# EAGLE design k64f-kit (EAGLE 9.6.2)
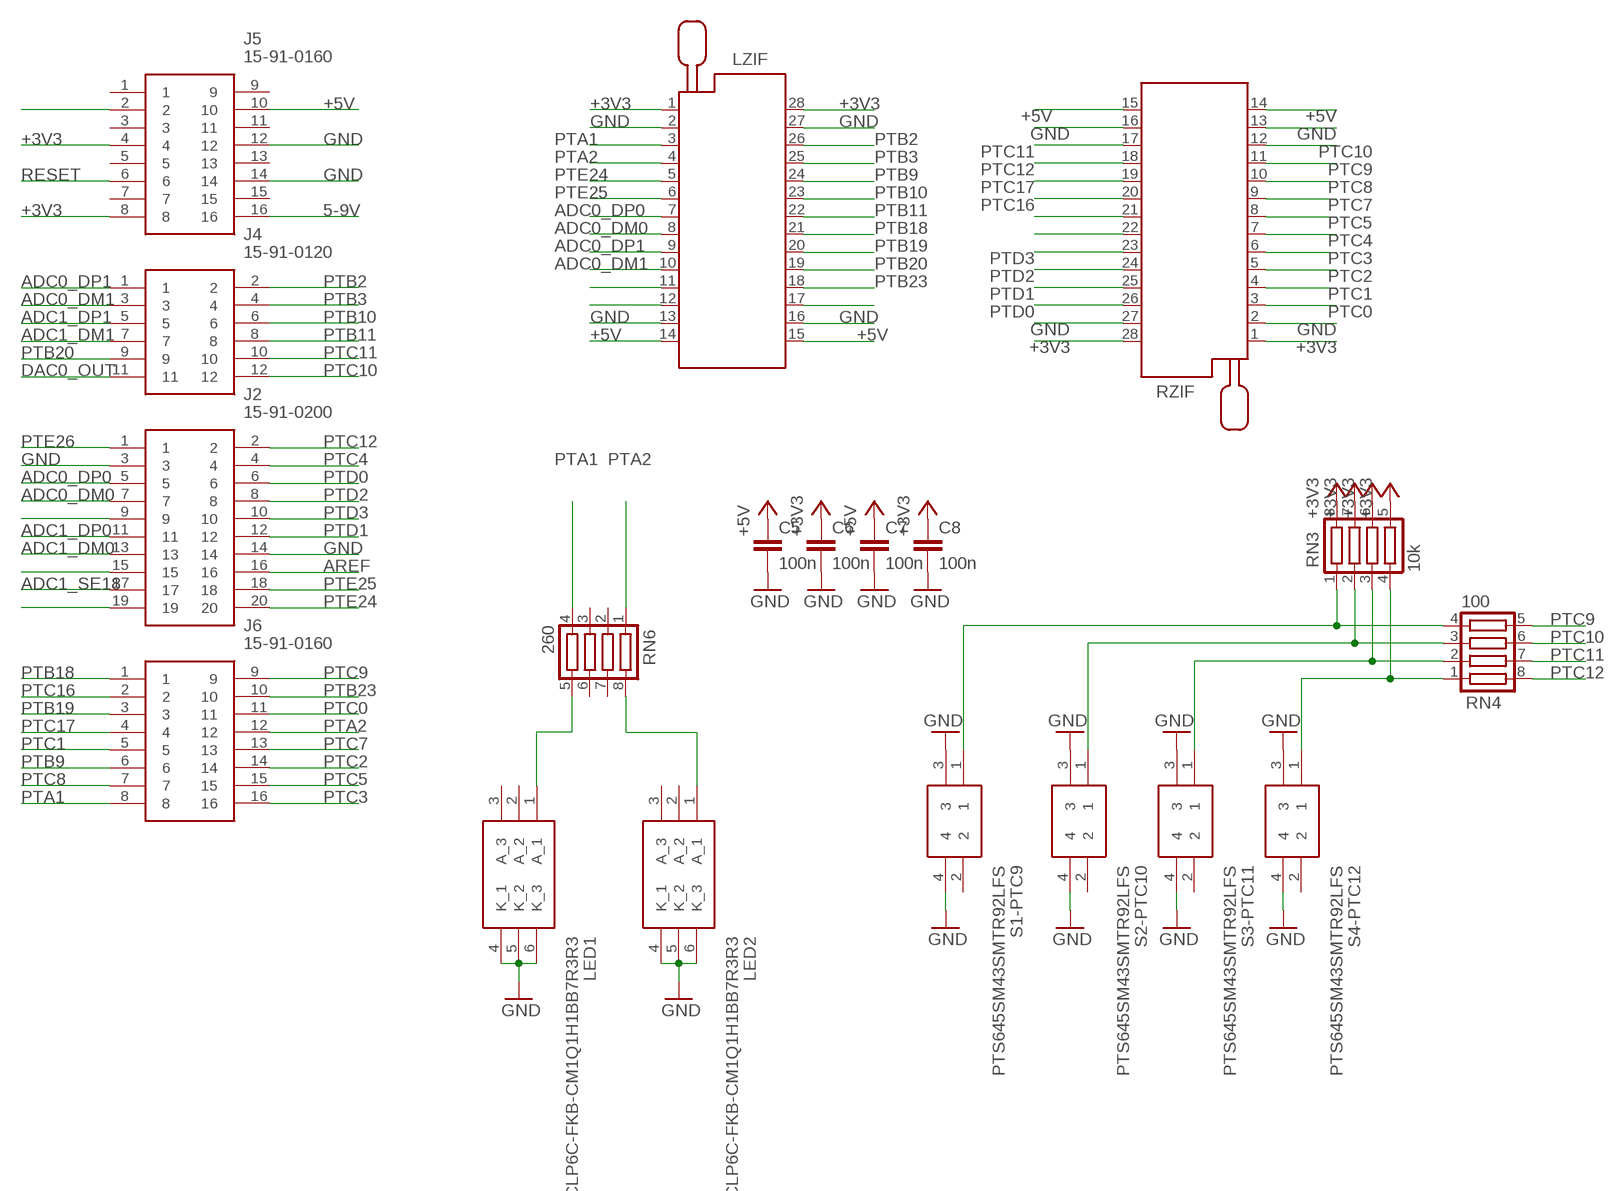
[diagram p0: schematic, sheet 1]

## Parts
C5  100n  C-EUC1206  [C1206]
C6  100n  C-EUC1206  [C1206]
C7  100n  C-EUC1206  [C1206]
C8  100n  C-EUC1206  [C1206]
J2  15-91-0200  [15910200]
J4  15-91-0120  [15910120]
J5  15-91-0160  [15910160]
J6  15-91-0160  [15910160]
LED1  CLP6C-FKB-CM1Q1H1BB7R3R3  [CLP6CFKBCM1Q1H1BB7R3R3]
LED2  CLP6C-FKB-CM1Q1H1BB7R3R3  [CLP6CFKBCM1Q1H1BB7R3R3]
LZIF  228-22-602  [228-1277-00-0602J]
RN3  10k  CTS742C083  [CTS742C083]
RN4  100  CTS742C083  [CTS742C083]
RN6  260  CTS742C083  [CTS742C083]
RZIF  228-22-602  [228-1277-00-0602J]
S1-PTC9  PTS645SM43SMTR92LFS  [PTS645(SMT)]
S2-PTC10  PTS645SM43SMTR92LFS  [PTS645(SMT)]
S3-PTC11  PTS645SM43SMTR92LFS  [PTS645(SMT)]
S4-PTC12  PTS645SM43SMTR92LFS  [PTS645(SMT)]

## Nets
5-9V: J5.16
+3V3: C6.1 C8.1 J5.4 J5.8 LZIF.1 LZIF.28 RN3.5 RN3.6 RN3.7 RN3.8 RZIF.1 RZIF.28
+5V: C5.1 C7.1 J5.10 LZIF.14 LZIF.15 RZIF.14 RZIF.15
ADC0_DM0: J2.7 LZIF.8
ADC0_DM1: J4.3 LZIF.10
ADC0_DP0: J2.5 LZIF.7
ADC0_DP1: J4.1 LZIF.9
ADC1_DM0: J2.13
ADC1_DM1: J4.7
ADC1_DP0: J2.11
ADC1_DP1: J4.5
ADC1_SE18: J2.17
AREF: J2.16
DAC0_OUT: J4.11
GND: C5.2 C6.2 C7.2 C8.2 J2.3 J2.14 J5.12 J5.14 LED1.4(K_1) LED1.5(K_2) LED1.6(K_3) LED2.4(K_1) LED2.5(K_2) LED2.6(K_3) LZIF.2 LZIF.13 LZIF.16 LZIF.27 RZIF.2 RZIF.13 RZIF.16 RZIF.27 S1-PTC9.3 S1-PTC9.4 S2-PTC10.3 S2-PTC10.4 S3-PTC11.3 S3-PTC11.4 S4-PTC12.3 S4-PTC12.4
N$1: J5.2
N$10: RN3.1 RN4.4 S1-PTC9.1
N$11: RN3.2 RN4.3 S2-PTC10.1
N$12: LZIF.11
N$13: LZIF.12
N$19: RN3.3 RN4.2 S3-PTC11.1
N$20: RN3.4 RN4.1 S4-PTC12.1
N$27: LZIF.17
N$35: J2.15
N$37: J2.19
N$38: LED2.1(A_1) RN6.8
N$39: LED1.1(A_1) RN6.5
N$46: J2.9
N$50: RZIF.22
N$51: RZIF.21
PTA1: J6.8 LZIF.3 RN6.1
PTA2: J6.12 LZIF.4 RN6.4
PTB2: J4.2 LZIF.26
PTB3: J4.4 LZIF.25
PTB9: J6.6 LZIF.24
PTB10: J4.6 LZIF.23
PTB11: J4.8 LZIF.22
PTB18: J6.1 LZIF.21
PTB19: J6.3 LZIF.20
PTB20: J4.9 LZIF.19
PTB23: J6.10 LZIF.18
PTC0: J6.11 RZIF.3
PTC1: J6.5 RZIF.4
PTC2: J6.14 RZIF.5
PTC3: J6.16 RZIF.6
PTC4: J2.4 RZIF.7
PTC5: J6.15 RZIF.8
PTC7: J6.13 RZIF.9
PTC8: J6.7 RZIF.10
PTC9: J6.9 RN4.5 RZIF.11
PTC10: J4.12 RN4.6 RZIF.12
PTC11: J4.10 RN4.7 RZIF.17
PTC12: J2.2 RN4.8 RZIF.18
PTC16: J6.2 RZIF.20
PTC17: J6.4 RZIF.19
PTD0: J2.6 RZIF.26
PTD1: J2.12 RZIF.25
PTD2: J2.8 RZIF.24
PTD3: J2.10 RZIF.23
PTE24: J2.20 LZIF.5
PTE25: J2.18 LZIF.6
PTE26: J2.1
RESET: J5.6
Unconnected: J5.1 J5.3 J5.5 J5.7 J5.9 J5.11 J5.13 J5.15 LED1.2(A_2) LED1.3(A_3) LED2.2(A_2) LED2.3(A_3) RN6.2 RN6.3 RN6.6 RN6.7 S1-PTC9.2 S2-PTC10.2 S3-PTC11.2 S4-PTC12.2

## Library data of the parts
C5-C8 = rcl:C-EU: CAPACITOR, European symbol; SPICEPREFIX: C
J2 = 15-91-0200:15-91-0200: Headers & Wire Housings HDR DUAL SMT 20P Source: Datasheet <https://componentsearchengine.com/Datasheets/1/15-91-0200.pdf>; DESCRIPTION: Headers & Wire Housings HDR DUAL SMT 20P; HEIGHT: 9.66mm; MANUFACTURER_NAME: Molex; MANUFACTURER_PART_NUMBER: 15-91-0200; MOUSER_PART_NUMBER: 538-15-91-0200; MOUSER_PRICE-STOCK: https://www.mouser.com/Search/Refine.aspx?Keyword=538-15-91-0200
J4 = 15-91-0120:15-91-0120: Headers & Wire Housings SMT BRKWY HEADER 12 PIN GOLD Source: Datasheet <https://componentsearchengine.com/Datasheets/1/15-91-0120.pdf>; DESCRIPTION: Headers & Wire Housings SMT BRKWY HEADER 12 PIN GOLD; HEIGHT: 9.91mm; MANUFACTURER_NAME: Molex; MANUFACTURER_PART_NUMBER: 15-91-0120; MOUSER_PART_NUMBER: 538-15-91-0120; MOUSER_PRICE-STOCK: https://www.mouser.com/Search/Refine.aspx?Keyword=538-15-91-0120
J5 J6 = 15-91-0160:15-91-0160: MOLEX - 15-91-2160 - CONNECTOR, HEADER, 16POS, 2ROW, 2.54MM Source: Datasheet <http://www.farnell.com/datasheets/2789117.pdf>; ALLIED_NUMBER: 70775727; ALLIED_PRICE-STOCK: https://www.alliedelec.com/molexincorporated-15-91-2160/70775727/; DESCRIPTION: MOLEX - 15-91-2160 - CONNECTOR, HEADER, 16POS, 2ROW, 2.54MM; HEIGHT: 9.91mm; MANUFACTURER_NAME: Molex; MANUFACTURER_PART_NUMBER: 15-91-2160; MOUSER_PART_NUMBER: 538-15-91-2160; MOUSER_PRICE-STOCK: https://www.mouser.com/Search/Refine.aspx?Keyword=538-15-91-2160
LED1 LED2 = CLP6C-FKB-CM1Q1H1BB7R3R3:CLP6C-FKB-CM1Q1H1BB7R3R3: Cree,LED,CLP6C-FKB-CM1Q1H1BB7R3R3 Cree CLP6C-FKB-CM1Q1H1BB7R3R3, CLP6 Series Green LED, 540 nm, PLCC 6, Round Lens SMD Package Source: Datasheet <http://docs-emea.rs-online.com/webdocs/0cdd/0900766b80cddec4.pdf>; DESCRIPTION: Cree,LED,CLP6C-FKB-CM1Q1H1BB7R3R3 Cree CLP6C-FKB-CM1Q1H1BB7R3R3, CLP6 Series Green LED, 540 nm, PLCC 6, Round Lens SMD Package; HEIGHT: 2.6mm; MANUFACTURER_NAME: Cree, Inc.; MANUFACTURER_PART_NUMBER: CLP6C-FKB-CM1Q1H1BB7R3R3; MOUSER_PART_NUMBER: 941-P6CFKBCM1Q1H17R3; MOUSER_PRICE-STOCK: https://www.mouser.com/Search/Refine.aspx?Keyword=941-P6CFKBCM1Q1H17R3; RS_PART_NUMBER: 8106939P; RS_PRICE-STOCK: http://uk.rs-online.com/web/p/products/8106939P
LZIF RZIF = zif28:228-?22-602
RN3 = resistor-net:CTS742C083: Chip Resistor Array 4 Single Resistor Source: http://www.ctscorp.com/components/Datasheets/CTSChipArrayDs.pdf; FARNELL: 1770137; OC_FARNELL: unknown; OC_NEWARK: unknown
RN4 = resistor-net:CTS742C083: Chip Resistor Array 4 Single Resistor Source: http://www.ctscorp.com/components/Datasheets/CTSChipArrayDs.pdf; FARNELL: 1770131; OC_FARNELL: unknown; OC_NEWARK: unknown
RN6 = resistor-net:CTS742C083: Chip Resistor Array 4 Single Resistor Source: http://www.ctscorp.com/components/Datasheets/CTSChipArrayDs.pdf; FARNELL: 2908182; OC_FARNELL: unknown; OC_NEWARK: unknown
S1-PTC9 S2-PTC10 S3-PTC11 S4-PTC12 = PTS645SM43SMTR92LFS:PTS645SM43SMTR92LFS: C & K COMPONENTS - PTS645SM43SMTR92LFS - SWITCH, SPST, 0.05A, 12VDC, SMD, 4.3MM Source: Datasheet <http://www.farnell.com/datasheets/1914518.pdf>; DESCRIPTION: C & K COMPONENTS - PTS645SM43SMTR92LFS - SWITCH, SPST, 0.05A, 12VDC, SMD, 4.3MM; FARNELL: 2320087; HEIGHT: mm; MANUFACTURER_NAME: C & K COMPONENTS; MANUFACTURER_PART_NUMBER: PTS645SM43SMTR92LFS; MOUSER_PART_NUMBER: 611-PTS645SM43SMTR92; MOUSER_PRICE-STOCK: https://www.mouser.com/Search/Refine.aspx?Keyword=611-PTS645SM43SMTR92

## Board
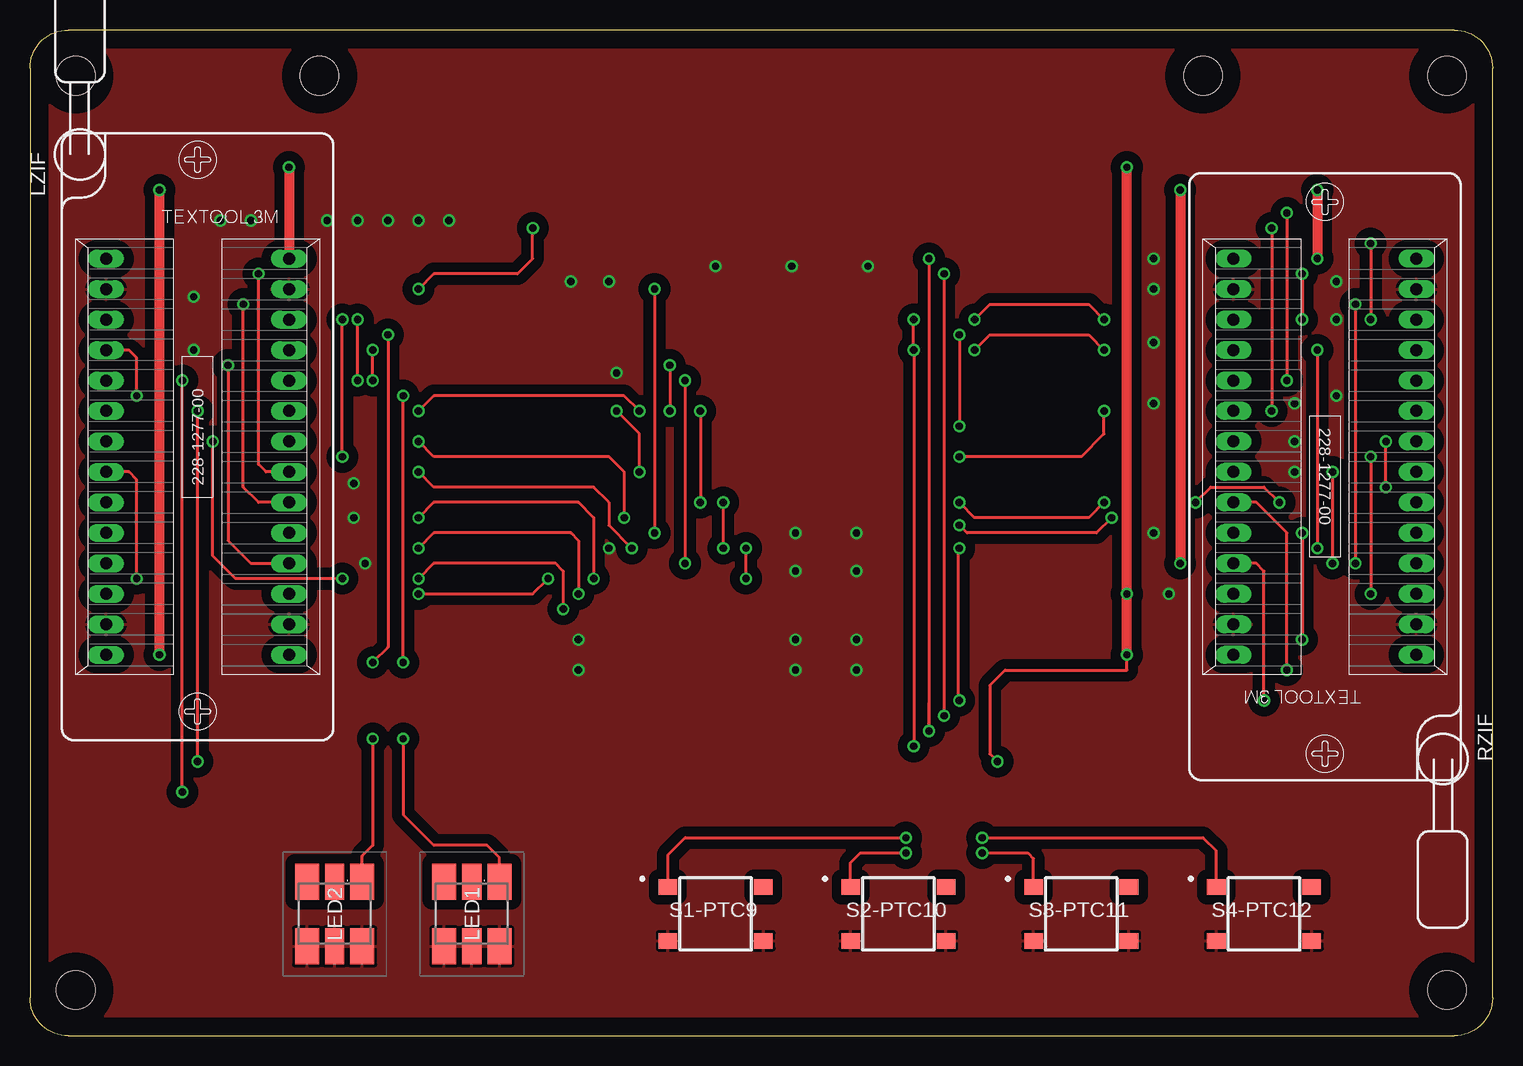
[diagram p1: board, top side]
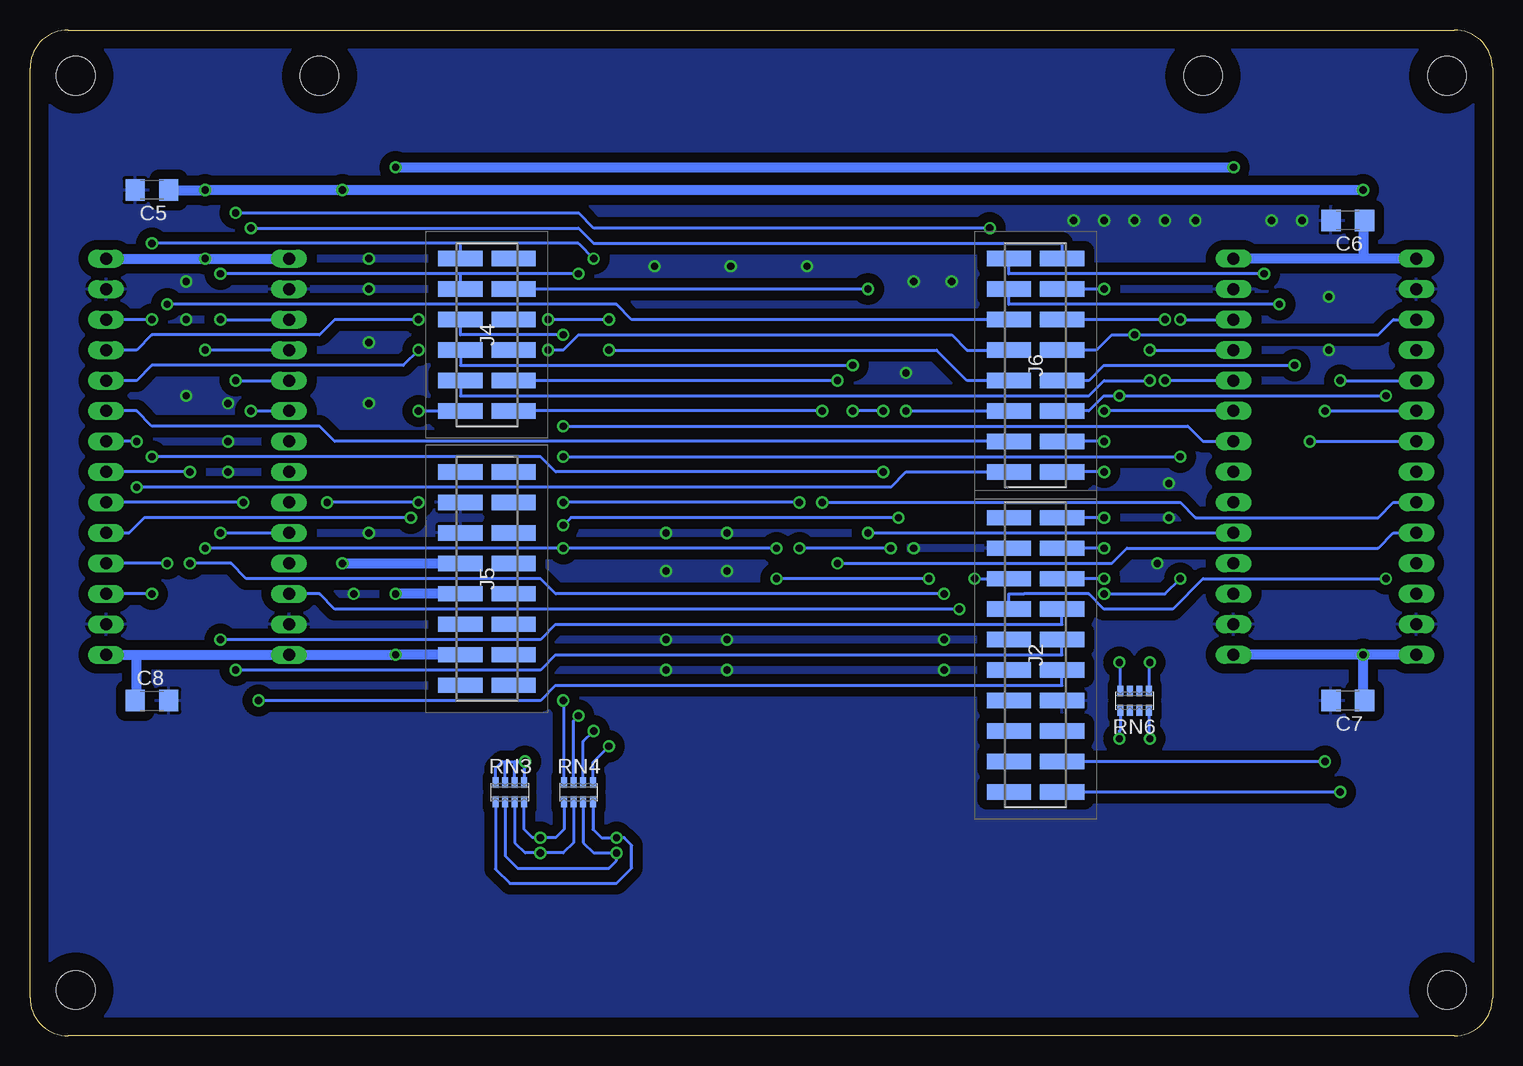
[diagram p2: board, bottom side, seen from below]

Size 121.92 x 83.82 mm. Coordinates in mm from the lower left corner, seen from the top.
Outline: 3.17,0 118.75,0 arc90 121.92,3.17 121.92,80.64 arc90 118.75,83.82 3.17,83.82 arc90 0,80.64 0,3.17 arc90 3.17,0
Copper layers (1*16): Top 0.035mm / dielectric 1.5mm / Bottom 0.035mm
Design rules "default *": minimum track width 10mil, minimum drill 24mil, track to track 8mil, track to pad 8mil, pad to pad 8mil, via to via 8mil, smd to smd 8mil, copper to edge 60mil, drill to drill 8mil, minimum pad ring 10mil, minimum via ring 8mil, stop-mask expansion 4mil, vias tented up to drill 0mil, thermal gap 10mil
Holes 3.2 mm at 3.81,80.01 118.11,80.01 3.81,3.81 118.11,3.81 24.13,80.01 97.79,80.01

### Footprints (pad centres in the part's own frame; a part is rotated, then mirrored left to right if it is on the bottom)
C1206 = smd 1.6 x 1.8: 1 -1.4,0; 2 1.4,0
15910200 = smd 1.27 x 3.68: 1 -11.43,-2.22; 2 -11.43,2.22; 3 -8.89,-2.22; 4 -8.89,2.22; 5 -6.35,-2.22; 6 -6.35,2.22; 7 -3.81,-2.22; 8 -3.81,2.22; 9 -1.27,-2.22; 10 -1.27,2.22; 11 1.27,-2.22; 12 1.27,2.22; 13 3.81,-2.22; 14 3.81,2.22; 15 6.35,-2.22; 16 6.35,2.22; 17 8.89,-2.22; 18 8.89,2.22; 19 11.43,-2.22; 20 11.43,2.22
15910120 = smd 1.27 x 3.68: 1 -6.35,-2.22; 2 -6.35,2.22; 3 -3.81,-2.22; 4 -3.81,2.22; 5 -1.27,-2.22; 6 -1.27,2.22; 7 1.27,-2.22; 8 1.27,2.22; 9 3.81,-2.22; 10 3.81,2.22; 11 6.35,-2.22; 12 6.35,2.22
15910160 = smd 1.27 x 3.68: 1 -8.89,-2.22; 2 -8.89,2.22; 3 -6.35,-2.22; 4 -6.35,2.22; 5 -3.81,-2.22; 6 -3.81,2.22; 7 -1.27,-2.22; 8 -1.27,2.22; 9 1.27,-2.22; 10 1.27,2.22; 11 3.81,-2.22; 12 3.81,2.22; 13 6.35,-2.22; 14 6.35,2.22; 15 8.89,-2.22; 16 8.89,2.22
CLP6CFKBCM1Q1H1BB7R3R3 = smd 3 x 2: 1 -2.7,2.3; 3 -2.7,-2.3; 4 2.7,-2.3; 6 2.7,2.3 | smd 3 x 1.6: 2 -2.7,0; 5 2.7,0
228-1277-00-0602J = drill 1 long: 1 -16.51,-7.62; 2 -13.97,-7.62; 3 -11.43,-7.62; 4 -8.89,-7.62; 5 -6.35,-7.62; 6 -3.81,-7.62; 7 -1.27,-7.62; 8 1.27,-7.62; 9 3.81,-7.62; 10 6.35,-7.62; 11 8.89,-7.62; 12 11.43,-7.62; 13 13.97,-7.62; 14 16.51,-7.62; 15 16.51,7.62; 16 13.97,7.62; 17 11.43,7.62; 18 8.89,7.62; 19 6.35,7.62; 20 3.81,7.62; 21 1.27,7.62; 22 -1.27,7.62; 23 -3.81,7.62; 24 -6.35,7.62; 25 -8.89,7.62; 26 -11.43,7.62; 27 -13.97,7.62; 28 -16.51,7.62
CTS742C083 = smd 0.5 x 0.9: 1 -1.2,-0.8; 2 -0.4,-0.8; 3 0.4,-0.8; 4 1.2,-0.8; 5 1.2,0.8; 6 0.4,0.8; 7 -0.4,0.8; 8 -1.2,0.8
PTS645(SMT) = smd 1.55 x 1.3: 1 -3.975,2.25; 2 3.975,2.25; 3 -3.975,-2.25; 4 3.975,-2.25

### Placement (x,y rotation side)
C5  111.76,70.48 180 bottom
C6  12.06,67.94 180 bottom
C7  12.06,27.94 180 bottom
C8  111.76,27.94 0 bottom
J2  38.1,31.75 270 bottom
J4  83.82,58.42 90 bottom
J5  83.82,38.1 90 bottom
J6  38.1,55.88 270 bottom
LED1  36.83,10.16 270 top
LED2  25.4,10.16 270 top
LZIF  13.97,48.26 270 top
RN3  81.92,20.32 0 bottom
RN4  76.2,20.32 0 bottom
RN6  29.84,27.94 180 bottom
RZIF  107.95,48.26 90 top
S1-PTC9  57.15,10.16 0 top
S2-PTC10  72.39,10.16 0 top
S3-PTC11  87.63,10.16 0 top
S4-PTC12  102.87,10.16 0 top

### Tracks (layer width: path | path; a pad name or v marks a point on that pad's centre or on a via)
+3V3  (via drill 0.61)
  Top 0.254: v80.64,22.86 80.01,23.5 80.01,29.21 81.28,30.48 91.44,30.48 v91.44,31.75
  Top 0.813: v91.44,31.75 v91.44,36.83 v91.44,72.39 | v21.59,72.39 LZIF.28
  Bottom 0.254: RN3.5 80.72,22.79 v80.64,22.86 81.28,22.86 81.52,22.86 | RN3.8 83.11,22.3 82.55,22.86 82.31,22.86 | RN3.7 82.31,22.86 | 82.31,22.86 81.52,22.86 | RN3.6 81.52,22.86
  Bottom 0.813: LZIF.1 10.79,64.77 | 10.79,64.77 LZIF.28 | RZIF.1 113.03,31.75 | 113.03,31.75 RZIF.28 v91.44,31.75 J5.4 | v91.44,72.39 v21.59,72.39 | J5.8 v91.44,36.83 | C8.1 113.03,28.07 113.03,31.75 | C6.1 10.79,67.81 10.79,64.77
+5V  (via drill 0.61)
  Top 0.813: v10.79,31.75 v10.79,70.48 | v107.31,70.48 v107.31,64.77 | v95.89,70.48 v95.89,39.37
  Bottom 0.813: LZIF.14 v10.79,31.75 | v10.79,31.75 LZIF.15 | RZIF.14 v107.31,64.77 RZIF.15 | v10.79,70.48 v95.89,70.48 v107.31,70.48 C5.1 | v95.89,39.37 J5.10 | C7.1 10.79,28.07 v10.79,31.75
ADC0_DM0  (via drill 0.61)
  Top 0.254: v8.89,38.1 8.89,46.35 8.26,46.99 LZIF.8
  Bottom 0.254: v8.89,38.1 24.13,38.1 26.67,35.56 32.38,35.56 33.66,36.83 39.05,36.83 40.01,36.83 40.32,36.83 J2.7
ADC0_DM1  (via drill 0.61)
  Top 0.254: v54.61,54.61 v54.61,39.37
  Bottom 0.254: v54.61,39.37 31.75,39.37 30.48,40.64 9.53,40.64 8.26,41.91 LZIF.10 | v54.61,54.61 J4.3
ADC0_DP0  (via drill 0.61)
  Top 0.254: v26.04,38.1 17.14,38.1 15.24,40.01 v15.24,49.53 | v43.18,38.1 41.91,36.83 v32.38,36.83
  Bottom 0.254: v32.38,36.83 27.3,36.83 v26.04,38.1 | v15.24,49.53 LZIF.7 | v43.18,38.1 J2.5
ADC0_DP1  (via drill 0.61)
  Top 0.254: v55.88,52.07 v55.88,44.45
  Bottom 0.254: v55.88,44.45 26.04,44.45 24.77,43.18 9.53,43.18 8.26,44.45 LZIF.9 | v55.88,52.07 J4.1
GND  (via drill 0.61)
  other vias: 48.26,40.64 93.66,41.91 15.88,67.94 18.41,67.94 24.77,67.94 27.3,67.94 29.84,67.94 32.38,67.94 34.92,67.94 45.09,62.87 48.26,62.87 69.85,64.14 63.5,64.14 57.15,64.14 93.66,52.7 93.66,57.78 105.41,49.53 105.41,46.99 105.41,52.7 108.9,59.69 93.66,64.77 108.9,53.34 94.93,36.83 63.82,38.73 68.9,38.73 68.9,33.02 63.82,33.02 68.9,30.48 63.82,30.48 45.72,33.02 45.72,30.48 63.82,41.91 68.9,41.91 48.9,55.24 26.99,43.18 26.99,46.04 27.94,39.37 13.65,57.15 13.65,61.59 108.9,62.87 93.66,62.23
  pour Top (isolate 0.813): -1.91,87 124.46,87 124.46,-2.54 -1.91,-2.54
  pour Bottom (isolate 0.813): -2.54,88.27 125.73,88.27 125.73,-3.17 -2.54,-3.17
N$10  (via drill 0.61)
  Top 0.254: v73.03,16.51 54.61,16.51 53.17,15.07 S1-PTC9.1
  Bottom 0.254: RN4.4 75,17.21 74.3,16.51 v73.03,16.51 72.39,16.51 71.75,15.88 71.75,13.97 73.03,12.7 81.92,12.7 83.11,13.9 RN3.1
N$11  (via drill 0.61)
  Top 0.254: S2-PTC10.1 68.42,14.44 69.22,15.24 v73.03,15.24
  Bottom 0.254: RN4.3 75.8,16.11 74.93,15.24 v73.03,15.24 73.03,14.61 73.66,13.97 81.28,13.97 82.31,15.01 RN3.2
N$19  (via drill 0.61)
  Top 0.254: S3-PTC11.1 83.66,14.77 83.19,15.24 v79.38,15.24
  Bottom 0.254: RN4.2 76.6,16.11 77.47,15.24 v79.38,15.24 80.64,15.24 81.52,16.11 RN3.3
N$20  (via drill 0.61)
  Top 0.254: S4-PTC12.1 98.89,15.4 97.79,16.51 v79.38,16.51
  Bottom 0.254: RN4.1 77.4,17.21 78.11,16.51 v79.38,16.51 80.01,16.51 80.72,17.21 RN3.4
N$38  (via drill 0.6)
  Top 0.254: v28.57,24.77 28.57,15.88 27.7,15 LED2.1
  Bottom 0.254: v28.57,24.77 28.64,24.84 RN6.8
N$39  (via drill 0.6)
  Top 0.254: v31.11,24.77 31.11,18.41 33.66,15.88 38.1,15.88 39.13,14.85 LED1.1
  Bottom 0.254: RN6.5 31.05,25.47 31.11,25.4 v31.11,24.77
PTA1  (via drill 0.6, 0.61)
  Top 0.254: v29.84,58.42 29.84,32.38 v28.57,31.11
  Bottom 0.254: LZIF.3 8.26,59.69 9.53,58.42 v29.84,58.42 31.75,58.42 33.02,57.15 J6.8 | v28.57,31.11 28.64,31.05 RN6.1
PTA2  (via drill 0.6, 0.61)
  Top 0.254: v8.89,53.34 8.89,56.52 8.26,57.15 LZIF.4 | v31.11,31.11 v31.11,53.34
  Bottom 0.254: v8.89,53.34 v31.11,53.34 32.38,53.34 33.66,52.07 J6.12 | RN6.4 31.05,31.05 v31.11,31.11
PTB2  (via drill 0.61)
  Top 0.254: v26.04,48.26 v26.04,59.69 | v77.47,48.26 87.63,48.26 89.53,50.16 v89.53,52.07
  Bottom 0.254: v77.47,48.26 v26.04,48.26 | v26.04,59.69 LZIF.26 | v89.53,52.07 J4.2
PTB3  (via drill 0.61)
  Top 0.254: v28.57,54.61 v28.57,57.15
  Bottom 0.254: v28.57,54.61 32.38,54.61 33.66,53.34 86.04,53.34 J4.4 | v28.57,57.15 LZIF.25
PTB9  (via drill 0.61)
  Top 0.254: v27.3,54.61 v27.3,59.69
  Bottom 0.254: LZIF.24 v27.3,54.61 | v27.3,59.69 J6.6
PTB10  (via drill 0.61)
  Top 0.254: v53.34,55.88 v53.34,52.07 | v32.38,52.07 33.66,53.34 49.53,53.34 v50.8,52.07
  Bottom 0.254: LZIF.23 v32.38,52.07 | v50.8,52.07 v53.34,52.07 | J4.6 86.04,55.88 v53.34,55.88
PTB11  (via drill 0.61)
  Top 0.254: v77.47,58.42 v77.47,50.8
  Bottom 0.254: v77.47,50.8 25.4,50.8 24.13,49.53 LZIF.22 | J4.8 86.04,58.42 v77.47,58.42
PTB18  (via drill 0.61)
  Top 0.254: LZIF.21 19.68,46.99 19.05,47.62 v19.05,63.5
  Bottom 0.254: J6.1 40.32,63.5 v19.05,63.5
PTB19  (via drill 0.61)
  Top 0.254: LZIF.20 19.05,44.45 17.78,45.72 v17.78,60.96
  Bottom 0.254: J6.3 40.32,60.96 v17.78,60.96
PTB20  (via drill 0.61)
  Top 0.254: v52.07,62.23 v52.07,41.91
  Bottom 0.254: v52.07,41.91 LZIF.19 | v52.07,62.23 J4.9
PTB23  (via drill 0.61)
  Top 0.254: v16.51,55.88 16.51,41.27 18.41,39.37 LZIF.18
  Bottom 0.254: v16.51,55.88 32.38,55.88 33.66,54.61 J6.10
PTC0  (via drill 0.61)
  Top 0.254: v50.8,46.99 50.8,50.16 v48.9,52.07 | v111.76,48.26 v111.76,36.83
  Bottom 0.254: v50.8,46.99 78.11,46.99 79.38,48.26 v111.76,48.26 | v111.76,36.83 RZIF.3 | v48.9,52.07 J6.11
PTC1  (via drill 0.61)
  Top 0.254: v110.49,60.96 v110.49,39.37
  Bottom 0.254: v110.49,60.96 73.03,60.96 71.75,59.69 J6.5 | v110.49,39.37 RZIF.4
PTC2  (via drill 0.61)
  Top 0.254: v49.53,43.18 49.53,46.99 48.26,48.26 33.66,48.26 v32.38,49.53 | v77.47,42.55 78.11,41.91 88.9,41.91 v90.17,43.18
  Bottom 0.254: v49.53,43.18 76.83,43.18 v77.47,42.55 | v90.17,43.18 112.39,43.18 113.67,41.91 RZIF.5 | v32.38,49.53 J6.14
PTC3  (via drill 0.61)
  Top 0.254: v50.16,40.64 48.26,42.55 48.26,44.45 46.99,45.72 33.66,45.72 v32.38,46.99 | v57.78,44.45 v57.78,40.64 | v89.53,44.45 88.27,43.18 78.74,43.18 v77.47,44.45 | v97.16,44.45 98.42,45.72 102.87,45.72 v104.14,44.45
  Bottom 0.254: v50.16,40.64 v57.78,40.64 | v57.78,44.45 v77.47,44.45 | v89.53,44.45 v97.16,44.45 | v104.14,44.45 RZIF.6 | v32.38,46.99 J6.16
PTC4  (via drill 0.61)
  Top 0.254: v45.72,36.83 45.72,41.27 45.09,41.91 33.66,41.91 v32.38,40.64 | v108.58,39.37 v108.58,46.99
  Bottom 0.254: v45.72,36.83 78.11,36.83 79.38,38.1 103.89,38.1 105.16,39.37 v108.58,39.37 | v108.58,46.99 RZIF.7 | v32.38,40.64 J2.4
PTC5  (via drill 0.61)
  Top 0.254: v113.03,45.72 v113.03,49.53
  Bottom 0.254: v113.03,49.53 RZIF.8 | v113.03,45.72 50.16,45.72 48.9,46.99 J6.15
PTC7
  Bottom 0.254: RZIF.9 113.03,52.07 111.76,50.8 97.79,50.8 96.52,49.53 J6.13
PTC8  (via drill 0.61)
  Top 0.254: v78.74,57.15 80.01,58.42 88.27,58.42 v89.53,57.15
  Bottom 0.254: v78.74,57.15 77.47,57.15 76.2,58.42 45.09,58.42 43.81,57.15 J6.7 | v89.53,57.15 90.81,55.88 111.76,55.88 113.03,54.61 RZIF.10
PTC9  (via drill 0.61)
  Top 0.254: v73.66,24.13 73.73,24.2 73.73,57.08 v73.66,57.15 v73.66,59.69 | v78.74,59.69 80.01,60.96 88.27,60.96 v89.53,59.69
  Bottom 0.254: v73.66,57.15 46.35,57.15 43.81,54.61 J6.9 | RN4.5 75,22.79 v73.66,24.13 | v73.66,59.69 v78.74,59.69 | v89.53,59.69 96.52,59.69 97.79,58.42 111.76,58.42 113.03,57.15 RZIF.11
PTC10  (via drill 0.61)
  Top 0.254: v111.76,66.04 v111.76,59.69 | v74.93,64.77 v74.93,25.4 74.93,27.7
  Bottom 0.254: v74.93,64.77 76.2,66.04 86.04,66.04 | 86.04,66.04 v111.76,66.04 | J4.12 86.04,66.04 | RN4.6 75.8,24.53 v74.93,25.4 | v111.76,59.69 RZIF.12
PTC11  (via drill 0.61)
  Top 0.254: v106.05,63.5 v106.05,59.69 | v76.2,63.5 v76.2,26.67 76.2,26.6
  Bottom 0.254: v76.2,63.5 86.04,63.5 | 86.04,63.5 v106.05,63.5 | J4.10 86.04,63.5 | RN4.7 76.6,26.27 v76.2,26.67 | v106.05,59.69 RZIF.17
PTC12  (via drill 0.61)
  Top 0.254: v46.99,38.1 46.99,43.18 45.72,44.45 33.66,44.45 v32.38,43.18 | v59.69,38.1 v59.69,40.64 | v107.31,57.15 v107.31,40.64 | v77.47,40.64 77.4,40.57 77.4,28.01 v77.47,27.94
  Bottom 0.254: v46.99,38.1 v59.69,38.1 | v59.69,40.64 v77.47,40.64 v107.31,40.64 | v32.38,43.18 J2.2 | RN4.8 77.4,27.87 v77.47,27.94 | RZIF.18 v107.31,57.15
PTC16  (via drill 0.61)
  Top 0.254: v103.5,67.31 v103.5,52.07
  Bottom 0.254: v103.5,67.31 76.2,67.31 74.93,66.04 35.88,66.04 J6.2 | v103.5,52.07 RZIF.20
PTC17  (via drill 0.61)
  Top 0.254: v41.91,67.31 41.91,64.77 40.64,63.5 33.66,63.5 v32.38,62.23 | v104.78,68.58 v104.78,54.61
  Bottom 0.254: v41.91,67.31 74.93,67.31 76.2,68.58 v104.78,68.58 | v104.78,54.61 RZIF.19 | v32.38,62.23 J6.4
PTD0  (via drill 0.61)
  Top 0.254: v44.45,35.56 44.45,38.73 43.81,39.37 33.66,39.37 v32.38,38.1
  Bottom 0.254: v44.45,35.56 96.52,35.56 97.79,36.83 RZIF.26 | v32.38,38.1 J2.6
PTD1  (via drill 0.61)
  Top 0.254: v102.87,27.94 102.87,38.73 102.23,39.37 RZIF.25
  Bottom 0.254: v102.87,27.94 79.38,27.94 78.11,29.21 35.88,29.21 J2.12
PTD2  (via drill 0.61)
  Top 0.254: v106.05,41.91 v106.05,33.02
  Bottom 0.254: v106.05,33.02 79.38,33.02 78.11,34.29 35.88,34.29 J2.8 | v106.05,41.91 RZIF.24
PTD3  (via drill 0.61)
  Top 0.254: RZIF.23 102.23,44.45 104.78,41.91 v104.78,30.48
  Bottom 0.254: v104.78,30.48 79.38,30.48 78.11,31.75 35.88,31.75 J2.10
PTE24  (via drill 0.61)
  Top 0.254: v12.7,20.32 v12.7,54.61
  Bottom 0.254: v12.7,54.61 LZIF.5 | v12.7,20.32 J2.20
PTE25  (via drill 0.61)
  Top 0.254: v13.97,22.86 v13.97,52.07
  Bottom 0.254: v13.97,52.07 LZIF.6 | v13.97,22.86 J2.18

### Text on the board
Top: Popis pouze z TOP strany. Vrstva 100!!!
tStop: K64F-KIT v4 2020 / david.seidl@vsb.cz / petr.olivka@vsb.cz
HorniPopis: K64F-KIT | PTA1 | PTA2 | PTC9 | PTC10 | PTC11 | PTC12